# Altium schematic sheet ADPL_afs.SchDoc
size A
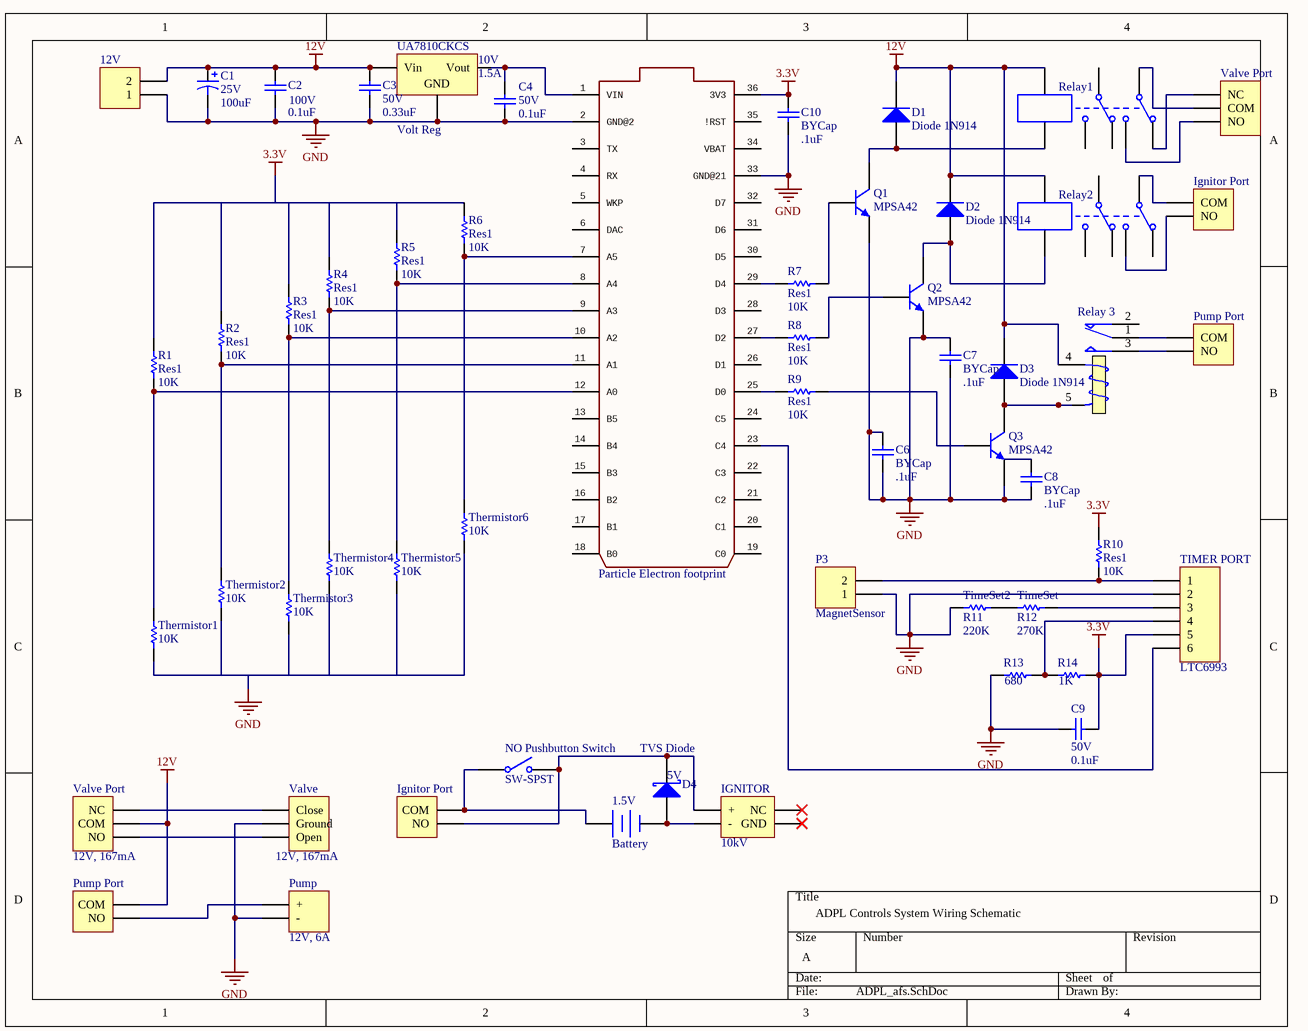
[diagram p0: ADPL_afs.SchDoc]

## Parts
(Parts that share a designator on the sheet are numbered #1, #2 ... from top to bottom, then left to right.)
1.5V  Battery  [BAT-2]
12V  (no value)  [HDR1X2]
?  Particle Electron footprint  [ELECTRON]
C1  25V  value 100uF  [RB7.6-15]
C2  100V  value 0.1uF  [C1206]
C3  50V  value 0.33uF  [RAD-0.3]
C4  50V  value 0.1uF  [RAD-0.3]
C6  BYCap  value .1uF  [C1206]
C7  BYCap  value .1uF  [C1206]
C8  BYCap  value .1uF  [C1206]
C9  50V  value 0.1uF  [RAD-0.3]
C10  BYCap  value .1uF  [C1206]
D1  Diode 1N914  [DO-35]
D2  Diode 1N914  [DO-35]
D3  Diode 1N914  [DO-35]
D4  TVS Diode  Working Voltage: 5V  [TO-220AC]
IGNITOR  10kV  [HDR2X2]
Ignitor_Port#1  1.5V, 280-320mA  [HDR1X2]  (value not drawn)
Ignitor_Port#2  (no value)  [HDR1X2]
NO_Pushbutton_Switch  SW-SPST  [SPST-2]
P3  MagnetSensor  [HDR1X2]
Pump  12V, 6A  [HDR1X2]
Pump_Port#1  12V, 6A  [HDR1X2]  (value not drawn)
Pump_Port#2  (no value)  [HDR1X2]
Q1  MPSA42  [TO-92A]
Q2  MPSA42  [TO-92A]
Q3  MPSA42  [TO-92A]
R1  Res1  value 10K  [AXIAL-0.3]
R2  Res1  value 10K  [AXIAL-0.3]
R3  Res1  value 10K  [AXIAL-0.3]
R4  Res1  value 10K  [AXIAL-0.3]
R5  Res1  value 10K  [AXIAL-0.3]
R6  Res1  value 10K  [AXIAL-0.3]
R7  Res1  value 10K  [AXIAL-0.3]
R8  Res1  value 10K  [AXIAL-0.3]
R9  Res1  value 10K  [AXIAL-0.3]
R10  Res1  value 10K  [AXIAL-0.3]
R13  value 680  [AXIAL-0.3]  (hidden comment: Res1)
R14  value 1K  [AXIAL-0.3]  (hidden comment: Res1)
Relay1  817-FTR-F1CA012V  [Relay-DPDT_custom]  (value not drawn)
Relay2  817-FTR-F1CA012V  [Relay-DPDT_custom]  (value not drawn)
Relay_3  (no value)  [MODULE5B]
Thermistor1  value 10K  [AXIAL-0.3]  (hidden comment: Res1)
Thermistor2  value 10K  [AXIAL-0.3]  (hidden comment: Res1)
Thermistor3  value 10K  [AXIAL-0.3]  (hidden comment: Res1)
Thermistor4  value 10K  [AXIAL-0.3]  (hidden comment: Res1)
Thermistor5  value 10K  [AXIAL-0.3]  (hidden comment: Res1)
Thermistor6  value 10K  [AXIAL-0.3]  (hidden comment: Res1)
TIMER_PORT  LTC6993  [HDR1X6]
TimeSet  R12  value 270K  [AXIAL-0.3]
TimeSet2  R11  value 220K  [AXIAL-0.3]
UA7810CKCS  Volt Reg  Voltage output: 10V  Current output: 1.5A  [D2PAK_N]
Valve  12V, 167mA  [HDR1X3]
Valve_Port#1  12V, 167mA  [HDR1X3]  (value not drawn)
Valve_Port#2  12V, 167mA  [HDR1X3]

## Nets
3.3V: ?.36(3V3) C9.1 C10.2 R10.2 R14.1 TIMER_PORT.5
12V: 12V.2 C1.1 C2.2 C3.2 D1.2(K) D2.2(K) D3.2(K) Pump_Port#2.2(COM) Relay1.7 Relay2.7 Relay_3.4(T1) UA7810CKCS.1(Vin) Valve_Port#2.2(COM)
GND: 12V.1 ?.2(GND@2) ?.33(GND@21) C1.2 C2.1 C3.1 C4.1 C6.1 C6.2 C7.1 C7.2 C8.1 C9.2 C10.1 P3.1 Pump.2(-) Q1.1(E) Q2.1(E) Q3.1(E) R13.2 TIMER_PORT.2 TimeSet2.1 UA7810CKCS.2(GND) Valve.2(Ground)
Net1.5V_1: 1.5V.1(+) Ignitor_Port#2.2(COM) NO_Pushbutton_Switch.1(COMMON)
Net1.5V_2: 1.5V.2(-) D4.3(A) IGNITOR.3(-)
Net?_1: ?.1(VIN) C4.2 UA7810CKCS.3(Vout)
Net?_7: ?.7(A5) R6.1 Thermistor6.2
Net?_8: ?.8(A4) R5.1 Thermistor5.2
Net?_9: ?.9(A3) R4.1 Thermistor4.2
Net?_10: ?.10(A2) R3.1 Thermistor3.2
Net?_11: ?.11(A1) R2.1 Thermistor2.2
Net?_12: ?.12(A0) R1.1 Thermistor1.2
Net?_23: ?.23(C4) TIMER_PORT.6
Net?_25: ?.25(D0) R9.1
Net?_27: ?.27(D2) R8.1
Net?_29: ?.29(D4) R7.1
NetD1_1: D1.1(A) Q1.3(C) Relay1.8
NetD2_1: D2.1(A) Q2.3(C) Relay2.8
NetD3_1: D3.1(A) Q3.3(C) Relay_3.5(T2)
NetD4_1: D4.1(K) IGNITOR.1(+) Ignitor_Port#2.1(NO) NO_Pushbutton_Switch.2(NO)
NetIgnitor_Port#1_1: Ignitor_Port#1.1(COM) Relay2.1
NetIgnitor_Port#1_2: Ignitor_Port#1.2(NO) Relay2.3
NetP3_2: P3.2 R10.1 TIMER_PORT.1
NetPump_1: Pump.1(+) Pump_Port#2.1(NO)
NetPump_Port#1_1: Pump_Port#1.1(COM) Relay_3.1(COM)
NetPump_Port#1_2: Pump_Port#1.2(NO) Relay_3.3(NO)
NetQ1_2: Q1.2(B) R7.2
NetQ2_2: Q2.2(B) R8.2
NetQ3_2: Q3.2(B) R9.2
NetR13_1: R13.1 R14.2 TIMER_PORT.4
NetRelay1_1: Relay1.1 Valve_Port#1.2(COM)
NetRelay1_2: Relay1.2 Valve_Port#1.1(NC)
NetRelay1_3: Relay1.3 Valve_Port#1.3(NO)
NetTIMER_PORT_3: TIMER_PORT.3 TimeSet.2
NetTimeSet_1: TimeSet.1 TimeSet2.2
NetValve_1: Valve.1(Close) Valve_Port#2.3(NC)
NetValve_3: Valve.3(Open) Valve_Port#2.1(NO)

Not connected (* = marked no-connect by the designer): ? 3(TX) 4(RX) 5(WKP) 6(DAC) 13(B5) 14(B4) 15(B3) 16(B2) 17(B1) 18(B0) 19(C0) 20(C1) 21(C2) 22(C3) 24(C5) 26(D1) 28(D3) 30(D5) 31(D6) 32(D7) 34(VBAT) 35(!RST); C8 2; IGNITOR 2(NC)* 4(GND)*; R1 2; R2 2; R3 2; R4 2; R5 2; R6 2; Relay1 4 5 6; Relay2 2 4 5 6; Relay_3 2(NC); Thermistor1 1; Thermistor2 1; Thermistor3 1; Thermistor4 1; Thermistor5 1; Thermistor6 1

## Notes on the sheet
- ADPL Controls System Wiring Schematic

## Library data of the parts
1.5V = Battery: Multicell Battery; Published: 24-Mar-1999; LatestRevisionDate: 17-Jul-2002; LatestRevisionNote: Re-released for DXP Platform.; PackageReference: BAT-2; Publisher: Altium Limited; PackageDescription: Battery; 2 Leads
12V Ignitor_Port#1 Ignitor_Port#2 Pump_Port#1 Pump_Port#2 = Header 2: Header, 2-Pin; LatestRevisionDate: 17-Jul-2002; LatestRevisionNote: Re-released for DXP Platform.; Publisher: Altium Limited
? = ELECTRON_WITH_HEADERS
C1 = Cap Pol1: Polarized Capacitor (Radial); Published: 8-Jun-2000; LatestRevisionDate: 17-Jul-2002; LatestRevisionNote: Re-released for DXP Platform.; PackageReference: RB7.6-15; Publisher: Altium Limited; PackageDescription: Polarized Capacitor (Radial); 2 Leads
C2 C6-C8 C10 = Cap Semi: Capacitor (Semiconductor SIM Model); Part#: 581-SA111E104MAR; Published: 8-Jun-2000; LatestRevisionDate: 29-May-2009; LatestRevisionNote: IPC-7351 Footprint Added.; PackageReference: C1206; Publisher: Altium Limited; PackageDescription: Chip Capacitor
C3 C4 = Cap: Capacitor; Published: 8-Jun-2000; LatestRevisionDate: 17-Jul-2002; LatestRevisionNote: Re-released for DXP Platform.; PackageReference: RAD-0.3; Publisher: Altium Limited; PackageDescription: Radial Cap, Thru-Hole; 2 Leads; 0.3 in Pin Spacing
C9 = cap: Capacitor; Published: 8-Jun-2000; LatestRevisionDate: 17-Jul-2002; LatestRevisionNote: Re-released for DXP Platform.; PackageReference: RAD-0.3; Publisher: Altium Limited; PackageDescription: Radial Cap, Thru-Hole; 2 Leads; 0.3 in Pin Spacing
D1-D3 = Diode 1N914: High Conductance Fast Diode; Published: 8-Jun-2000; LatestRevisionDate: 17-Jul-2002; LatestRevisionNote: Re-released for DXP Platform.; DatasheetVersion: 1997; PackageReference: DO-35; Publisher: Altium Limited; PackageDescription: Diode, Axial; Body 3.8 x 1.9 mm (LxDia. max), Lead Dia. 0.53 mm (max); Code_JEDEC: DO-204-AH; ComponentLink1Description: Manufacturer Link; ComponentLink1URL: http://www.fairchildsemi.com/; ComponentLink2Description: Datasheet; ComponentLink2URL: http://www.fairchildsemi.com/ds/1N%2F1N4448.pdf
D4 = Diode 10TQ040: TVS Diode - Birectional; Part#: SA5.0CA; Note: Terminal 2 is the TAB and is electrically connected to the cathode; Clamping voltage: 9.6V; Published: 8-Jun-2000; LatestRevisionDate: 17-Jul-2002; LatestRevisionNote: Re-released for DXP Platform.; DatasheetVersion: PD-2.057B; PackageVersion: Feb-1998; PackageReference: TO-220AC; Publisher: Altium Limited; PackageDescription: TO, Thru-Hole, Vertical, Heatsink Mounted; 3 In-Line Leads (1 Absent); Pitch 2.54 mm; ComponentLink1Description: Manufacturer Link; ComponentLink1URL: http://www.irf.com/
IGNITOR = Header 2X2: Header, 2-Pin, Dual row; LatestRevisionDate: 17-Jul-2002; LatestRevisionNote: Re-released for DXP Platform.; Publisher: Altium Limited
NO_Pushbutton_Switch = SW-SPST: Single-Pole, Single-Throw Switch; Published: 24-Mar-1999; LatestRevisionDate: 17-Jul-2002; LatestRevisionNote: Re-released for DXP Platform.; PackageReference: SPST-2; Publisher: Altium Limited; PackageDescription: Switch; 2 Leads
P3 = Header 2: Header, 2-Pin; Resistance: Contact on maximum resistance: ≤10kΩ   Open contact minimum resistance: ≥500kΩ; LatestRevisionDate: 17-Jul-2002; LatestRevisionNote: Re-released for DXP Platform.; Publisher: Altium Limited; Source: http://www.amazon.com/GERI-Counter-Digital-Proximity-Magnetic/dp/B01875612U/ref=sr_1_2?ie=UTF8&qid=1456764906&sr=8-2&keywords=magnetic+counter
Pump = Header 2: Header, 2-Pin; Input: 1.5VDC, 280-320mA; LatestRevisionDate: 17-Jul-2002; LatestRevisionNote: Re-released for DXP Platform.; Publisher: Altium Limited
Q1-Q3 = 2N3904: NPN General Purpose Amplifier; Part#: 512-MPSA42; Published: 8-Jun-2000; LatestRevisionDate: 17-Jan-2003; LatestRevisionNote: PCB Footprint replaced; DatasheetVersion: 1997; PackageVersion: Sep-1998; PackageReference: TO-92A; Publisher: Altium Limited; PackageDescription: TO, Flat Index; 3 In-Line, Axial Leads; Body Dia. 4.5mm; Leads 0.51 x 0.48 mm (max); ComponentLink1Description: Manufacturer Link; ComponentLink1URL: http://www.fairchildsemi.com/; ComponentLink2Description: Datasheet; ComponentLink2URL: http://www.fairchildsemi.com/ds/2N%2F2N3904.pdf
R1-R10 = Res1: Resistor; Published: 8-Jun-2000; LatestRevisionDate: 17-Jul-2002; LatestRevisionNote: Re-released for DXP Platform.; PackageReference: AXIAL-0.3; Publisher: Altium Limited; PackageDescription: Axial Device, Thru-Hole; 2 Leads; 0.3 in Pin Spacing
R13 = Res1: Resistor; Part#: 660-CF1/4C681J; Published: 8-Jun-2000; LatestRevisionDate: 17-Jul-2002; LatestRevisionNote: Re-released for DXP Platform.; PackageReference: AXIAL-0.3; Publisher: Altium Limited; PackageDescription: Axial Device, Thru-Hole; 2 Leads; 0.3 in Pin Spacing
R14 = Res1: Resistor; Part#: 660-CF1/4CT52R102J; Published: 8-Jun-2000; LatestRevisionDate: 17-Jul-2002; LatestRevisionNote: Re-released for DXP Platform.; PackageReference: AXIAL-0.3; Publisher: Altium Limited; PackageDescription: Axial Device, Thru-Hole; 2 Leads; 0.3 in Pin Spacing
Relay1 Relay2 = Relay-DPDT_custom: Dual-Pole Dual-Throw Relay; Published: 24-Mar-1999; LatestRevisionDate: 17-Jul-2002; LatestRevisionNote: Re-released for DXP Platform.; PackageReference: DIP-P8; Publisher: Altium Limited; PackageDescription: Relay; 8 Leads
Relay_3 = Relay: SPDT Relay; Published: 8-Jun-2000; LatestRevisionDate: 17-Jul-2002; LatestRevisionNote: Re-released for DXP Platform.; PackageReference: MODULE5B; Publisher: Altium Limited; Part#: https://www.amazon.com/gp/product/B00PFA83RW/ref=oh_aui_search_detailpage?ie=UTF8&psc=1
Thermistor1 Thermistor2 Thermistor4-Thermistor6 = Res1: Resistor; Part#: NTCAIMME3C90373; Published: 8-Jun-2000; LatestRevisionDate: 17-Jul-2002; LatestRevisionNote: Re-released for DXP Platform.; PackageReference: AXIAL-0.3; Publisher: Altium Limited; PackageDescription: Axial Device, Thru-Hole; 2 Leads; 0.3 in Pin Spacing
Thermistor3 = Res1: Resistor; Part#: Dwyer I2-1B062; Published: 8-Jun-2000; LatestRevisionDate: 17-Jul-2002; LatestRevisionNote: Re-released for DXP Platform.; PackageReference: AXIAL-0.3; Publisher: Altium Limited; PackageDescription: Axial Device, Thru-Hole; 2 Leads; 0.3 in Pin Spacing
TIMER_PORT = Header 6: Header, 6-Pin; LatestRevisionDate: 17-Jul-2002; LatestRevisionNote: Re-released for DXP Platform.; Publisher: Altium Limited; Order: http://www.linear.com/product/LTC6993-1
TimeSet = Res1: Resistor; Part#: 660-CF1/4CT52R274J; Published: 8-Jun-2000; LatestRevisionDate: 17-Jul-2002; LatestRevisionNote: Re-released for DXP Platform.; PackageReference: AXIAL-0.3; Publisher: Altium Limited; PackageDescription: Axial Device, Thru-Hole; 2 Leads; 0.3 in Pin Spacing
TimeSet2 = Res1: Resistor; Part#: 660-CF1/4CT52R224J; Published: 8-Jun-2000; LatestRevisionDate: 17-Jul-2002; LatestRevisionNote: Re-released for DXP Platform.; PackageReference: AXIAL-0.3; Publisher: Altium Limited; PackageDescription: Axial Device, Thru-Hole; 2 Leads; 0.3 in Pin Spacing
UA7810CKCS = Volt Reg: Voltage Regulator; Part#: UA7810CKCS; Voltage input: 12.5-28V; Published: 24-Mar-1999; LatestRevisionDate: 29-May-2009; LatestRevisionNote: IPC-7351 Footprint Added.; PackageReference: D2PAK; Publisher: Altium Limited; PackageDescription: 3-Pin Transistor Outline Package 2.54 mm Pitch, 15.1 mm Lead Span
Valve Valve_Port#1 Valve_Port#2 = Header 3: Header, 3-Pin; Part#: CWX-15Q, CR-02; LatestRevisionDate: 17-Jul-2002; LatestRevisionNote: Re-released for DXP Platform.; Publisher: Altium Limited